# Altium schematic sheet Power.SchDoc: Power
size A4; Date: JUN 2020; ApprovedBy: Hören; CheckedBy: Mörz; Author: Rudziński; CompanyName: Semi-ATE; DrawnBy: Rudziński; Engineer: Hören; Organization: Semi-ATE; DocumentNumber: 4; Revision: V1.0; SheetNumber: 4; SheetTotal: 20
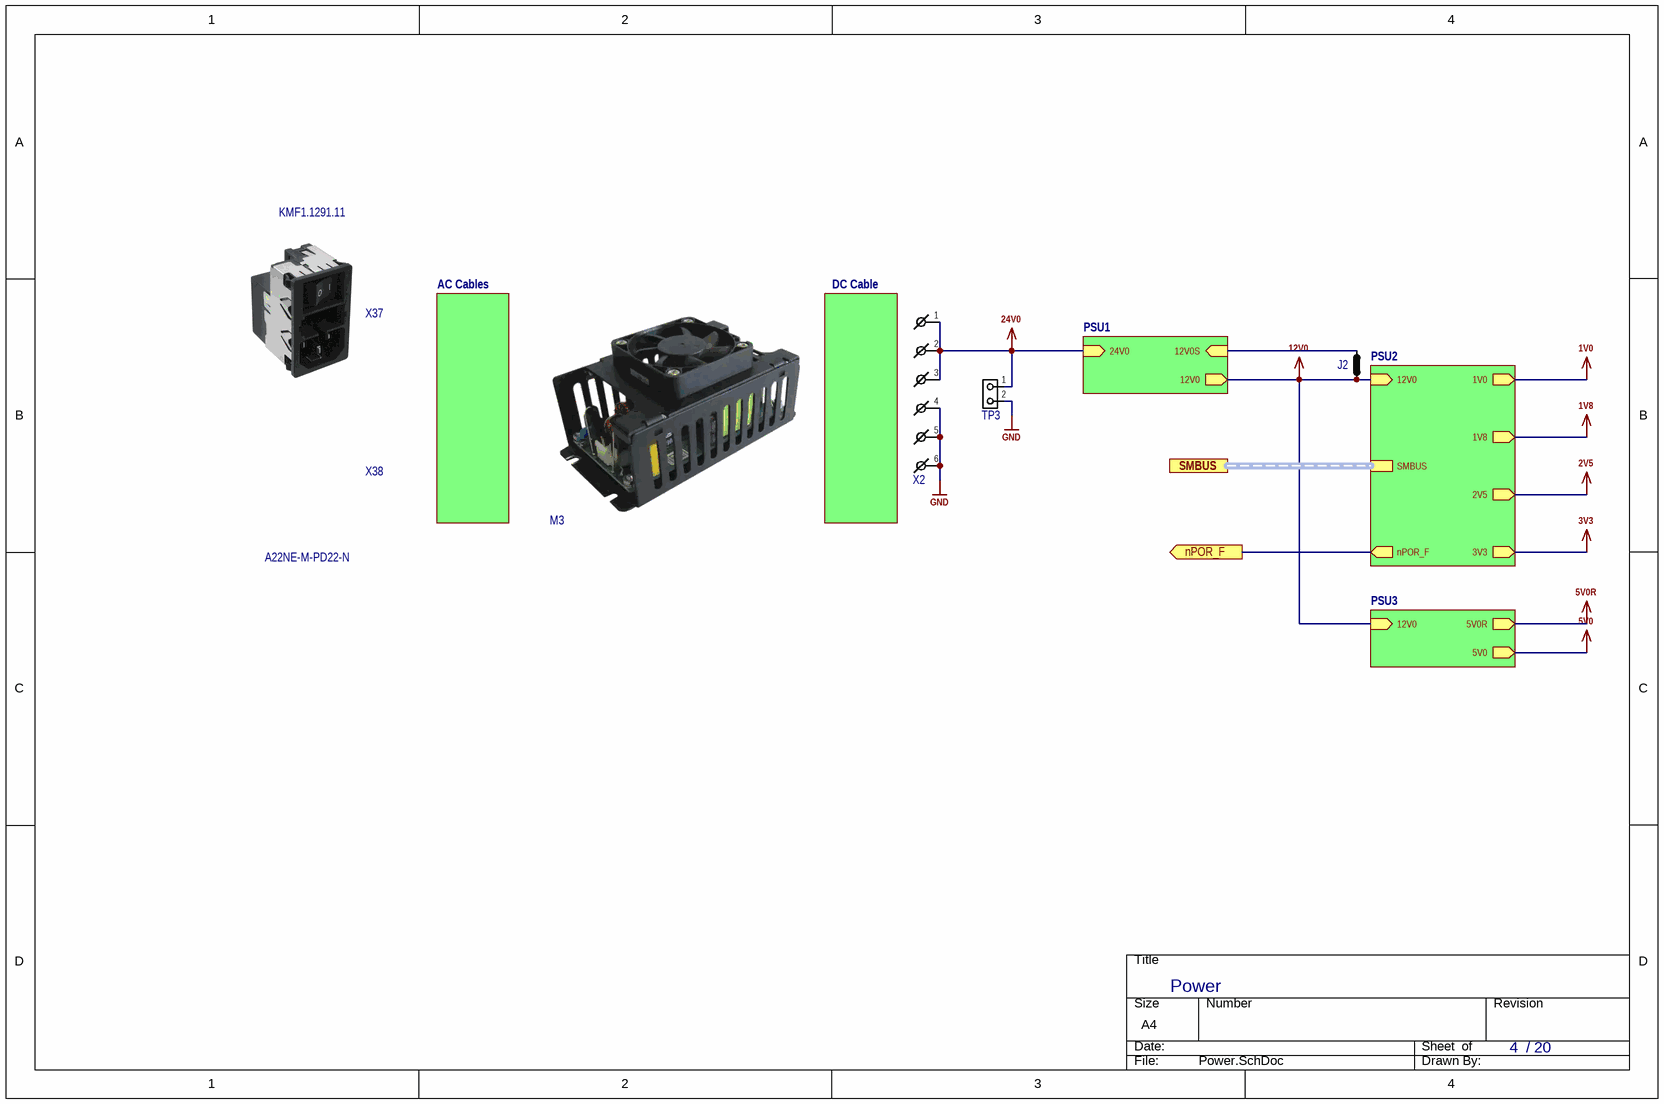
[diagram p0: Power.SchDoc]

## Parts
J2  J  [NT0201]  (value not drawn)  (net tie, no BOM)
M3  M  (value not drawn)  (mechanical)
TP3  TP  [DualTestpoint 100mils]  (value not drawn)  (no BOM)
X2  X  [B6PS-VH]  (value not drawn)
X37  07. Manufacturer  Part Number: KMF1.1291.11  (hidden comment: X)
X38  X  (value not drawn)

## Sub-sheets
AC Cables = AC-Cable.SchDoc: no entries
DC Cable = DC-Cable.SchDoc: no entries
PSU1 = PSU1.SchDoc: 12V0 (out), 12V0S (in), 24V0 (in)
PSU2 = PSU2.SchDoc: 12V0 (in), 3V3 (out), 1V0 (out), 1V8 (out), 2V5 (out), SMBUS (harness SMBUS), nPOR_F (out)
PSU3 = PSU3.SchDoc: 12V0 (in), 5V0R (out), 5V0 (out)

## Ports
nPOR_F (out), SMBUS (harness SMBUS)

## Nets
1V0: sheet PSU2/1V0
1V8: sheet PSU2/1V8
2V5: sheet PSU2/2V5
3V3: sheet PSU2/3V3
5V0: sheet PSU3/5V0
5V0R: sheet PSU3/5V0R
12V0: J2.1 ; sheet PSU2/12V0, sheet PSU1/12V0, sheet PSU3/12V0
24V0: TP3.1 X2.1 X2.2 X2.3 ; sheet PSU1/24V0
GND: TP3.2 X2.4 X2.5 X2.6
nPOR_F: port nPOR_F, sheet PSU2/nPOR_F
NetJ2_2: J2.2 ; sheet PSU1/12V0S

## Buses and harness runs
harness port SMBUS = sheet PSU2/SMBUS

## Notes on the sheet
- /
- designed by
- reviewed by
- last drawn by
- Project:
- Schematic:
- last printed
- DIN-A4 L
- sheets
- of
- File:

## Library data of the parts
J2 = NT: Net Tie; 13. Created Date/Name: AUG2018/Hören; 01. Distributor: N/A; 02. Distributor Part Number: N/A; 03. Unit Price: N/A; 04. Manufacturer: N/A; 05. Quantity: N/A; 06. Data Sheet: N/A; 07. Manufacturer  Part Number: N/A; 08. Inhouse Stock: N/A; 09. Operating Temperature: N/A; 10. Weight: N/A; 11. RoHS: N/A; 12.UL94 Flammability: N/A; ComponentLink1Description: Info; ComponentLink2Description: DataSheet
M3 = CUS150M-24/F: AC DC CONVERTER 85~264VAC --> 24VDC (6A); 04. Manufacturer: TDK-Lambda Americas Inc.; 07. Manufacturer  Part Number: CUS150M24/F; 03. Unit Price: 87.85; 13. Created Date/Name: AUG 2018 / Hören; 01. Distributor: DigiKey; 02. Distributor Part Number: 285-3030-ND; 09. Operating Temperature: -20°C ~ 85°C; 11. RoHS: YES; ComponentLink1Description: Info; ComponentLink1URL: https://www.digikey.de/product-detail/en/tdk-lambda-americas-inc/CUS150M24-F/285-3030-ND/7695382?cur=EUR&lang=en; ComponentLink2Description: DataSheet; ComponentLink2URL: https://product.tdk.com/info/en/catalog/datasheets/cus150m_e.pdf
TP3 = DualTestpoint 100mils: Dual testpoint, pitch 2.54mm; 04. Manufacturer: Samtec Inc.; 07. Manufacturer  Part Number: HMTSW-103-07-G-S-240; 03. Unit Price: 0.25; 13. Created Date/Name: AUG2018/Hören; 01. Distributor: Samtec Inc.; 02. Distributor Part Number: HMTSW-103-07-G-S-240; 11. RoHS: YES; ComponentLink1Description: Info; ComponentLink1URL: https://www.samtec.com/products/hmtsw-103-07-g-s-240; ComponentLink2Description: DataSheet; ComponentLink2URL: http://suddendocs.samtec.com/catalog_english/hmtsw.pdf
X2 = B6PS-VH: CONN HEADER R/A 6POS 3.96MM; 04. Manufacturer: JST Sales America Inc.; 07. Manufacturer  Part Number: B6PS-VH(LF)(SN); 03. Unit Price: 0.38; 13. Created Date/Name: AUG 2018 / Hören; System: Connector; 01. Distributor: DigiKey; 02. Distributor Part Number: 455-1652-ND; 09. Operating Temperature: -25°C ~ 85°C; 11. RoHS: YES; ComponentLink1Description: Info; ComponentLink1URL: https://www.digikey.de/product-detail/en/jst-sales-america-inc/B6PS-VH-LF-SN/455-1652-ND/926559; ComponentLink2Description: DataSheet; ComponentLink2URL: http://www.jst-mfg.com/product/pdf/eng/eVH.pdf
X37 = KMF1-1291-11: PWR ENT MOD RCPT IEC320-C14 PNL; 04. Manufacturer: Schurter Inc.; 03. Unit Price: 15.81; 13. Created Date/Name: AUG 2018 / Hören; 01. Distributor: DigiKey; 02. Distributor Part Number: 486-2292-ND; 11. RoHS: YES; ComponentLink1Description: Info; ComponentLink1URL: https://www.digikey.de/product-detail/en/schurter-inc/KMF1-1291-11/486-2292-ND/642117; ComponentLink2Description: DataSheet; ComponentLink2URL: https://us.schurter.com/bundles/snceschurter/epim/_ProdPool_/newDS/en/typ_KMF.pdf
X38 = A22NE-M-PD22-N: E-STOP 40MM 2NO/2NC TURN RESET; 04. Manufacturer: Omron Automation and Safety; 03. Unit Price: 61.54; 13. Created Date/Name: AUG 2018 / Hören; 01. Distributor: DigiKey; 02. Distributor Part Number: 236-A22NE-M-PD22-N-ND; 11. RoHS: YES; ComponentLink1Description: Info; ComponentLink1URL: https://www.digikey.de/products/en?keywords=A22NE-M-PD22-N; ComponentLink2Description: DataSheet; ComponentLink2URL: http://www.ia.omron.com/data_pdf/cat/a22ne-pd_a22ne-p_a22e_a263-e1_20_11_csm1265.pdf; 07. Manufacturer  Part Number: A22NE-M-PD22-N